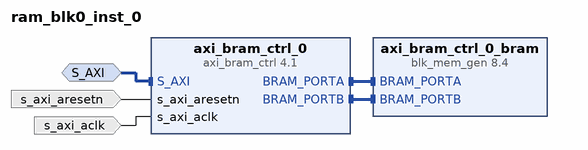
[diagram p0: block diagram of the top level]
# Vivado block design ram_blk0_inst_0, xczu7ev-ffvc1156-2-e, Vivado 2021.2
create_bd_design ram_blk0_inst_0

create_bd_intf_port -mode Slave -vlnv xilinx.com:interface:aximm_rtl:1.0 S_AXI
create_bd_port -dir I -type clk s_axi_aclk
create_bd_port -dir I -type rst s_axi_aresetn

create_bd_cell -type ip -vlnv xilinx.com:ip:axi_bram_ctrl:4.1 axi_bram_ctrl_0
create_bd_cell -type ip -vlnv xilinx.com:ip:blk_mem_gen:8.4 axi_bram_ctrl_0_bram
set_property -dict {CONFIG.Memory_Type True_Dual_Port_RAM} [get_bd_cells axi_bram_ctrl_0_bram]

# ---- connections ----

connect_bd_intf_net [get_bd_intf_pins axi_bram_ctrl_0_bram/BRAM_PORTA] [get_bd_intf_pins axi_bram_ctrl_0/BRAM_PORTA]
connect_bd_intf_net [get_bd_intf_pins axi_bram_ctrl_0_bram/BRAM_PORTB] [get_bd_intf_pins axi_bram_ctrl_0/BRAM_PORTB]
connect_bd_intf_net -intf_net axi_smc_M00_AXI [get_bd_intf_ports S_AXI] [get_bd_intf_pins axi_bram_ctrl_0/S_AXI]
connect_bd_net -net rst_ps8_0_99M_peripheral_aresetn [get_bd_ports s_axi_aresetn] [get_bd_pins axi_bram_ctrl_0/s_axi_aresetn]
connect_bd_net -net zynq_ultra_ps_e_0_pl_clk0 [get_bd_ports s_axi_aclk] [get_bd_pins axi_bram_ctrl_0/s_axi_aclk]

# ---- address map ----
assign_bd_address -offset 0xA0000000 -range 8K -target_address_space [get_bd_addr_spaces S_AXI] [get_bd_addr_segs axi_bram_ctrl_0/S_AXI/Mem0]

validate_bd_design
save_bd_design
